# EAGLE design magnet-node (EAGLE 6.5.0)
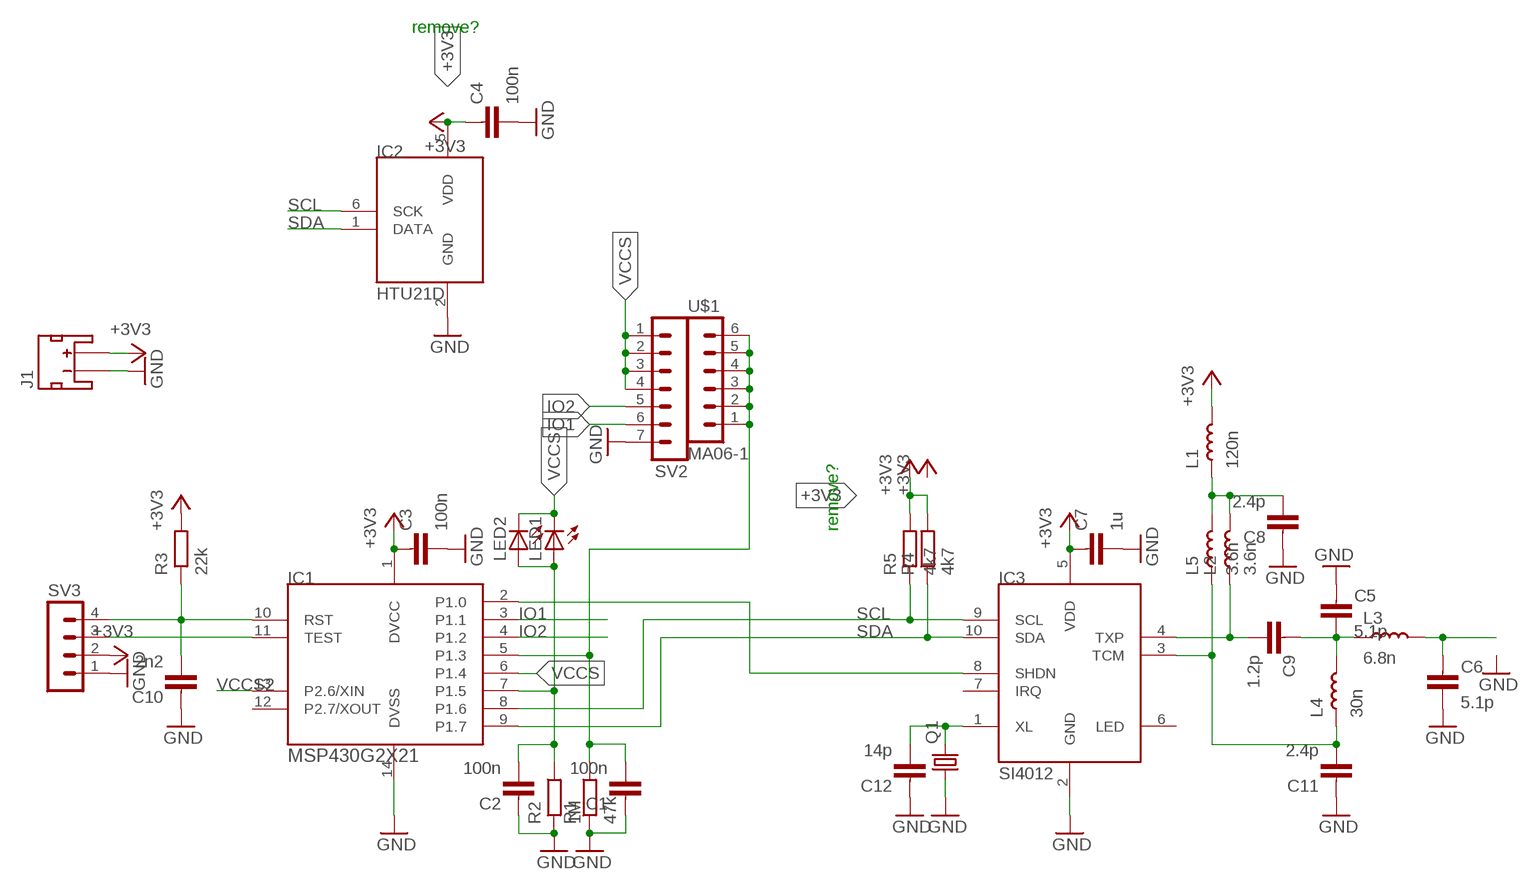
[diagram p0: schematic, sheet 1]

## Parts
C1  100n  CAPACITOR0603-N  [C0603-N]
C2  100n  CAPACITOR0603-N  [C0603-N]
C3  100n  CAPACITOR0603-N  [C0603-N]
C4  100n  CAPACITOR0603-N  [C0603-N]
C5  5.1p  CAPACITOR0603-N  [C0603-N]
C6  5.1p  CAPACITOR0603-N  [C0603-N]
C7  1u  CAPACITOR0603-N  [C0603-N]
C8  2.4p  CAPACITOR0603-N  [C0603-N]
C9  1.2p  CAPACITOR0603-N  [C0603-N]
C10  2n2  CAPACITOR0603-N  [C0603-N]
C11  2.4p  CAPACITOR0603-N  [C0603-N]
C12  14p  CAPACITOR0603-N  [C0603-N]
IC1  MSP430G2X21  [TSSOP14]
IC2  HTU21D  [DFN6-L]
IC3  SI4012  [MSOP10]
J1  JST_2MM_MALE_TH  [JST-2-TH]
L1  120n  INDUCTOR0603-N  [L0603-N]
L2  3.6n  INDUCTOR0402-N  [L0402-N]
L3  6.8n  INDUCTOR0402-N  [L0402-N]
L4  30n  INDUCTOR0402-N  [L0402-N]
L5  3.6n  INDUCTOR0402-N  [L0402-N]
LED1  LEDSMT1206  [1206]
LED2  LEDSMT1206  [1206]
Q1  CRYSTALHC49S  [HC49/S]
R1  47k  RESISTOR0603-N  [R0603-N]
R2  1M  RESISTOR0603-N  [R0603-N]
R3  22k  RESISTOR0603-N  [R0603-N]
R4  4k7  RESISTOR0603-N  [R0603-N]
R5  4k7  RESISTOR0603-N  [R0603-N]
SV2  MA07-1S  [MA07-1-SMD]
SV3  MA04-1E  [EDGE_4]
U$1  MA06-1  [MA06-1-SMD]

## Nets
+3V3: C3.1 C4.1 C7.1 IC1.1(DVCC) IC2.5(VDD) IC3.5(VDD) J1.1(+) L1.2 R3.2 R4.2 R5.2 SV3.2
GND: C1.1 C2.1 C3.2 C4.2 C5.1 C6.2 C7.2 C8.1 C10.1 C11.1 C12.1 IC1.14(DVSS) IC2.2(GND) IC3.2(GND) J1.2(-) Q1.1 R1.1 R2.1 SV2.7 SV3.1
IO1: IC1.3(P1.1) SV2.6
IO2: IC1.4(P1.2) SV2.5
N$1: IC1.2(P1.0) IC3.8(SHDN)
N$2: IC1.11(TEST) SV3.3
N$4: C8.2 L1.1 L2.2 L5.2
N$5: C12.2 IC3.1(XL) Q1.2
N$7: C5.2 C9.1 L3.1 L4.2
N$8: C11.2 IC3.3(TCM) L4.1 L5.1
N$9: C9.2 IC3.4(TXP) L2.1
N$10: C6.1 L3.2
N$12: C1.2 IC1.5(P1.3) R1.2 U$1.1 U$1.2 U$1.3 U$1.4 U$1.5 U$1.6
N$13: C2.2 IC1.7(P1.5) LED1.A LED2.A R2.2
N$15: C10.2 IC1.10(RST) R3.1 SV3.4
SCL: IC1.8(P1.6) IC2.6(SCK) IC3.9(SCL) R5.1
SDA: IC1.9(P1.7) IC2.1(DATA) IC3.10(SDA) R4.1
VCCS: IC1.6(P1.4) LED1.C LED2.C SV2.1 SV2.2 SV2.3 SV2.4
VCCS2: IC1.13(P2.6/XIN)
Unconnected: IC1.12(P2.7/XOUT) IC3.6(LED) IC3.7(IRQ)

## Notes on the sheet
- remove?
- remove?

## Library data of the parts
C1-C12 = passives-7351:CAPACITOR
IC1 = Mine:MSP430G2X21
IC2 = Mine:HTU21D
IC3 = Mine:SI4012
J1 = dtb:JST_2MM_MALE_TH: Mates to single-cell LiPo batteries. CONN-08352
L1-L5 = passives-7351:INDUCTOR
LED1 LED2 = led:LED: LED OSRAM: - CHIPLED LG R971, LG N971, LY N971, LG Q971, LY Q971, LO R971, LY R971 LH N974, LH R974 LS Q976, LO Q976, LY Q976 LO Q996 - Hyper CHIPLED LW Q18S LB Q993, LB Q99A, LB R99A - SideLED LS A670, LO A670, LY A670, LG A670, LP A670 LB A673, LV A673, LT A673, LW A673 LH A674 LY A675 LS A676, LA A676, LO A676, LY A676, LW A676 LS A679, LY A679, LG A679 - Hyper Micro SIDELED® LS Y876, LA Y876, LO Y876, LY Y876 LT Y87S - SmartLED LW L88C, LW L88S LB L89C, LB L89S, LG L890 LS L89K, LO L89K, LY L89K LS L896, LA L896, LO L896, LY L896 - TOPLED LS T670, LO T670, LY T670, LG T670, LP T670 LSG T670, LSP T670, LSY T670, LOP T670, LYG T670 LG T671, LOG T671, LSG T671 LB T673, LV T673, LT T673, LW T673 LH T674 LS T676, LA T676, LO T676, LY T676, LB T676, LH T676, LSB T676, LW T676 LB T67C, LV T67C, LT T67C, LS T67K, LO T67K, LY T67K, LW E67C LS E67B, LA E67B, LO E67B, LY E67B, LB E67C, LV E67C, LT E67C LW T67C LS T679, LY T679, LG T679 LS T770, LO T770, LY T770, LG T770, LP T770 LB T773, LV T773, LT T773, LW T773 LH T774 LS E675, LA E675, LY E675, LS T675 LS T776, LA T776, LO T776, LY T776, LB T776 LHGB T686 LT T68C, LB T68C - Hyper Mini TOPLED® LB M676 - Mini TOPLED Santana® LG M470 LS M47K, LO M47K, LY M47K Source: http://www.osram.convergy.de LUXEON: - LUMILED® LXK2-PW12-R00, LXK2-PW12-S00, LXK2-PW14-U00, LXK2-PW14-V00 LXK2-PM12-R00, LXK2-PM12-S00, LXK2-PM14-U00 LXK2-PE12-Q00, LXK2-PE12-R00, LXK2-PE12-S00, LXK2-PE14-T00, LXK2-PE14-U00 LXK2-PB12-K00, LXK2-PB12-L00, LXK2-PB12-M00, LXK2-PB14-N00, LXK2-PB14-P00, LXK2-PB14-Q00 LXK2-PR12-L00, LXK2-PR12-M00, LXK2-PR14-Q00, LXK2-PR14-R00 LXK2-PD12-Q00, LXK2-PD12-R00, LXK2-PD12-S00 LXK2-PH12-R00, LXK2-PH12-S00 LXK2-PL12-P00, LXK2-PL12-Q00, LXK2-PL12-R00 Source: www.luxeon.com KINGBRIGHT: KA-3528ASYC Source: www.kingbright.com
Q1 = crystal:CRYSTAL: CRYSTAL; OC_FARNELL: 1667008; OC_NEWARK: unknown
R1-R5 = passives-7351:RESISTOR
SV2 = Mine:MA07-1: PIN HEADER
SV3 = Mine:MA04-1: PIN HEADER
U$1 = Mine:MA06-1

## Board
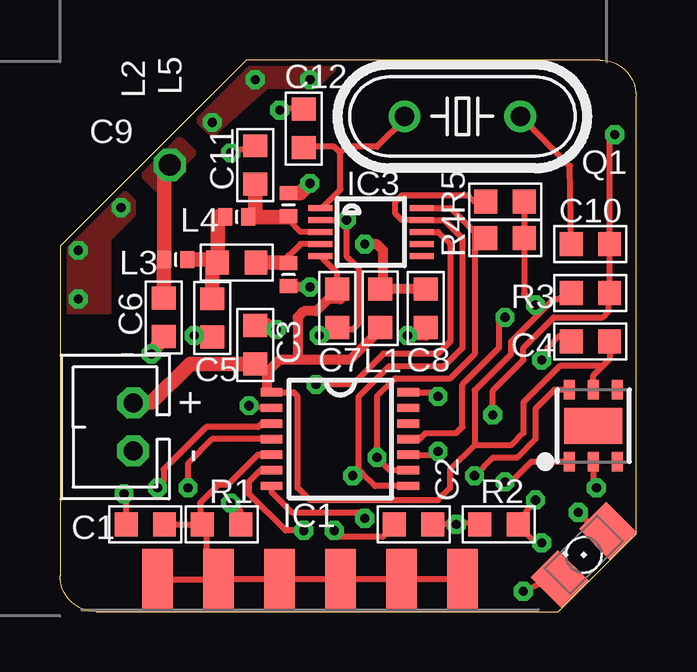
[diagram p1: board, top side]
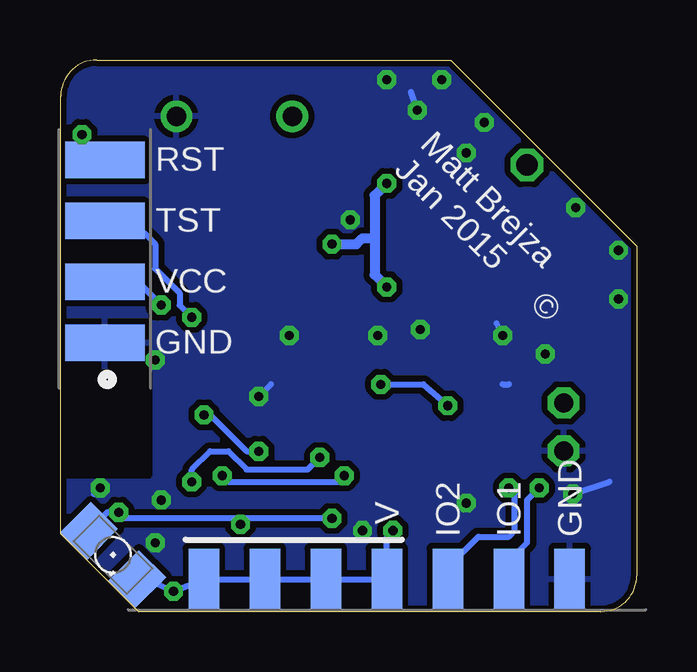
[diagram p2: board, bottom side, seen from below]

Size 24 x 23 mm. Coordinates in mm from the lower left corner, seen from the top.
Outline: 0,15.25 0,1.5 arc90 1.5,0 20.75,0 24,3.25 24,21.5 arc90 22.5,23 7.75,23 0,15.25
Copper layers (1*16): Top 0.035mm / dielectric 1.5mm / Bottom 0.035mm
Design rules "default *": minimum track width 8mil, minimum drill 15mil, track to track 8mil, track to pad 8mil, pad to pad 8mil, via to via 8mil, smd to smd 0mil, copper to edge 10mil, drill to drill 8mil, minimum pad ring 10mil, minimum via ring 8mil, stop-mask expansion 4mil, vias tented up to drill 15mil, thermal gap 10mil

### Footprints (pad centres in the part's own frame; a part is rotated, then mirrored left to right if it is on the bottom)
C0603-N = smd 0.95 x 1: 1 -0.8,0; 2 0.8,0
TSSOP14 = smd 0.9 x 0.35: 1 -2.875,1.95; 2 -2.875,1.3; 3 -2.875,0.65; 4 -2.875,0; 5 -2.875,-0.65; 6 -2.875,-1.3; 7 -2.875,-1.95; 8 2.825,-1.95; 9 2.825,-1.3; 10 2.825,-0.65; 11 2.825,0; 12 2.825,0.65; 13 2.825,1.3; 14 2.825,1.95
DFN6-L = smd 0.45 x 0.8: 1 -1,-1.5; 2 0,-1.5; 3 1,-1.5; 4 1,1.5; 5 0,1.5; 6 -1,1.5 | smd 2.4 x 1.5: EP 0,0
MSOP10 = smd 0.25 x 1: 1 -1,-2.113; 2 -0.5,-2.113; 3 0,-2.113; 4 0.5,-2.113; 5 1,-2.113; 6 1,2.113; 7 0.5,2.113; 8 0,2.113; 9 -0.5,2.113; 10 -1,2.113
JST-2-TH = drill 0.8 octagon: 1 1,0; 2 -1,0
L0603-N = smd 0.95 x 1: 1 -0.8,0; 2 0.8,0
L0402-N = smd 0.59 x 0.72: 1 -0.48,0; 2 0.48,0
1206 = smd 1.6 x 1.803: A -1.422,0; C 1.422,0
HC49/S = drill 0.813: 1 -2.413,0; 2 2.413,0
R0603-N = smd 0.95 x 1: 1 -0.8,0; 2 0.8,0
MA07-1-SMD = smd 1.27 x 2.54: 1 -7.62,0; 2 -5.08,0; 3 -2.54,0; 4 0,0; 5 2.54,0; 6 5.08,0; 7 7.62,0
EDGE_4 = smd 1.524 x 3.302: 1 -3.81,0; 2 -1.27,0; 3 1.27,0; 4 3.81,0
MA06-1-SMD = smd 1.27 x 2.54: 1 -7.62,0; 2 -5.08,0; 3 -2.54,0; 4 0,0; 5 2.54,0; 6 5.08,0

### Placement (x,y rotation side)
C1  3.56,3.63 0 top
C2  14.73,3.63 0 top
C3  8.13,11.12 90 top
C4  22.1,11.25 180 top
C5  6.35,12.24 90 top
C6  4.32,12.27 270 top
C7  11.56,12.65 270 top
C8  15.24,12.65 90 top
C9  7.37,14.55 0 top
C10  22.1,15.32 0 top
C11  8.13,18.62 270 top
C12  10.16,20.14 270 top
IC1  11.68,7.19 0 top
IC2  22.22,7.75 0 top
IC3  12.95,15.82 270 top
J1  3.05,7.7 90 top
L1  13.34,12.65 270 top
L2  9.53,14.05 270 top
L3  4.83,14.68 180 top
L4  7.37,16.46 180 top
L5  9.53,16.97 90 top
LED1  21.82,2.36 225 top
LED2  21.82,2.36 315 bottom
Q1  16.77,20.65 180 top
R1  6.73,3.63 180 top
R2  18.29,3.63 180 top
R3  22.1,13.28 180 top
R4  18.54,15.57 0 top
R5  18.54,17.09 0 top
SV2  10.41,1.35 0 bottom
SV3  22.16,15.02 90 bottom
U$1  11.68,1.35 0 top

### Tracks (layer width: path | path; a pad name or v marks a point on that pad's centre or on a via)
+3V3  (via drill 0.38)
  Top 0.229: 20.83,10.24 19.3,8.71
  Top 0.254: C3.1 8.38,10.24 8.64,9.98 | 8.64,9.22 IC1.1 9.73,9.14 9.91,8.97 9.91,5.16 10.41,4.65 15.75,4.65 16.26,5.16 16.26,5.92 17.27,6.93 | 11.68,13.03 C7.1 11.56,14.11 IC3.5 | 20.07,12.52 18.8,11.25 18.8,10.74 17.27,9.22 17.27,6.93 | 20.07,12.52 20.57,13.03 20.74,13.03 R3.2 | 20.07,12.52 v19.81,12.78 19.34,13.25 R4.2 R5.2 | IC2.5 22.22,9.85 22.61,10.24 | C4.1 22.9,10.53 22.61,10.24 | 22.61,10.24 20.83,10.24 | 19.3,8.71 19.3,7.44 18.8,6.93 17.27,6.93
  Top 0.406: 9.91,10.49 12.06,10.49 13.62,12.05 L1.2 | 9.91,10.49 9.14,10.49 8.64,9.98 8.64,9.22 | 11.68,13.03 11.18,13.03 10.67,12.52 10.16,12.52 9.91,12.27 9.91,10.49
  Top 0.61: C3.1 5.42,10.32 3.81,8.71 3.06,8.71 J1.1
  Bottom 0.254: SV3.2 21.86,14.05 21.08,14.05 v19.81,12.78
GND  (via drill 0.38)
  Top 0.254: IC3.2 v11.93,16.32 v11.94,16.33 11.94,14.81 12.45,14.3 12.45,12.01 12.19,11.76 11.68,11.76 | IC1.14 15.41,9.14 v15.75,8.97 | C11.1 v7.11,19.13 | C5.1 v5.59,11.51 | C3.2 8.68,12.1 v9.02,11.76 | C7.2 11.09,11.67 v10.79,11.51 | C12.1 9.75,20.99 v9.15,20.9 | IC2.2 22.22,5.29 v22.35,5.16 | C2.1 13.86,3.53 13.46,3.12 11.68,3.12 v11.43,3.38 | C4.2 20.83,11.51 20.32,11 20.32,10.74 v20.07,10.49 | C10.1 21.25,18.58 Q1.1 | v19.81,4.65 19.65,4.48 R2.1 19.09,3.59 19.81,2.87 v20.07,2.87 | C1.1 2.76,4.81 v2.67,4.9 | R1.1 7.53,4.18 v7.11,4.52
  Top 0.406: C8.1 15.24,11.51 v14.48,11.51
  Top 0.61: v3.81,10.74 C6.2
  Bottom 0.254: v11.94,16.33 12.19,16.33 | 5.59,9.47 5.33,9.47 | v15.75,8.97 15.24,9.47 | v5.59,11.51 5.84,12.01 | v10.79,11.51 10.67,11.51 | v9.15,20.9 9.4,21.67 | v22.35,5.16 22.61,4.9 | v11.43,3.38 11.18,3.38 | v19.81,4.65 19.81,4.9 | v2.67,4.9 1.14,5.41
  other vias: 0.76,13.03 2.54,16.84 0.76,15.06 8.13,22.17 6.35,20.4 10.41,22.17
  pour Bottom (isolate 0.254): 0,22.94 24.13,22.94 24.13,-0.18 0,-0.18
  pour Top: 0,12.52 2.03,12.52 2.03,15.57 3.05,16.59 3.05,17.09 2.29,17.86 2.03,17.86 -0.25,15.57 -0.25,12.78
  pour Top: 6.35,19.89 8.64,21.92 10.67,21.92 11.94,23.19 7.37,23.19 5.33,21.16 5.33,20.9
IO1  (via drill 0.38)
  Top 0.254: IC1.3 8.4,7.84 8.26,7.7 6.1,7.7 4.32,5.92 4.32,5.41 v4.06,5.16
  Bottom 0.254: SV2.6 5.33,2.11 4.57,2.87 4.57,4.65 v4.06,5.16
IO2  (via drill 0.38)
  Top 0.254: IC1.4 6.35,7.19 5.33,6.17 v5.33,5.16
  Bottom 0.254: SV2.5 7.87,1.85 6.6,3.12 5.33,3.12 5.08,3.38 5.08,4.9 v5.33,5.16
N$1  (via drill 0.38)
  Top 0.254: IC3.8 15.75,15.82 16.26,15.32 16.26,11.25 15.75,10.74 13.46,10.74 12.19,9.47 v10.67,9.47 | v7.87,8.59 8.78,8.46 IC1.2
  Bottom 0.254: v10.67,9.47 8.89,9.47 v7.87,8.59
N$2  (via drill 0.38)
  Top 0.254: v18.54,12.27 18.29,12.01 18.29,11 16.76,9.47 16.76,7.7 16.51,7.44 15.24,7.44 14.99,7.19 IC1.11
  Bottom 0.254: v18.54,12.27 19.05,12.78 19.05,13.28 20.07,14.3 20.07,15.32 21.04,16.29 SV3.3
N$3
  cutout Bottom: 23.88,9.98 20.32,9.98 20.32,5.66 24.13,5.66 24.13,6.17
N$4  (via drill 0.38)
  Top 0.254: L2.2 9.77,13.57 9.79,13.54
  Top 0.406: 10.3,17.74 v10.41,17.86 | v10.41,13.54 9.79,13.54 | 13.46,13.58 13.46,13.45 C8.2 | 13.46,13.58 13.46,15.06 13.21,15.32 v12.7,15.32 | 13.46,13.58 L1.1
  Top 0.61: L5.2 10.01,17.45 v10.41,17.86
  Bottom 0.406: v10.41,17.86 10.92,17.35 10.92,15.57 | 10.92,15.57 10.92,14.05 v10.41,13.54 | v12.7,15.32 11.68,15.32 11.43,15.57 10.92,15.57
N$5
  Top 0.254: IC3.1 10.91,16.82 11.68,17.6 11.68,19.13 | 11.68,19.13 11.43,19.38 10.25,19.38 C12.2 | Q1.2 14.36,20.53 13.21,19.38 11.94,19.38 11.68,19.13
N$7
  Top 0.61: 6.6,14.47 C9.1 | C5.2 6.35,14.39 C9.1 | L3.1 6.57,14.68 C9.1 | C9.1 6.57,16.46 L4.2
N$8
  Top 0.254: IC3.3 10.02,15.82 9.53,16.32
  Top 0.305: 9.53,16.32 L5.1
  Top 0.61: C11.2 8.13,16.44 | 8.13,16.44 9.48,16.44 L5.1 | 8.13,16.44 7.86,16.44 L4.1
N$9
  Top 0.254: IC3.4 10.03,15.32 9.53,14.82 | L2.1 9.54,14.55
  Top 0.305: 9.53,14.82 L2.1
  Top 0.61: C9.2 9.54,14.55
N$10  (via drill 0.9)
  Top 0.61: C6.1 4.32,14.65 L3.2 4.35,18.39 v4.57,18.62
  pour Top: 3.05,18.87 3.05,18.62 4.06,17.6 5.59,19.13 4.57,20.14
N$12
  Top 0.254: 6.1,1.47 6.1,3.63 R1.2 | 6.1,1.47 6.1,1.35 U$1.1 | C1.2 R1.2 | IC1.5 8.24,6.54 6.99,5.28 6.6,5.28 5.84,4.52 5.84,3.54 R1.2 | U$1.6 U$1.5 U$1.4 U$1.3 U$1.2 6.22,1.35 6.1,1.47
N$13  (via drill 0.38)
  Top 0.254: IC1.7 8.81,4.98 9.65,4.14 12.45,4.14 v12.7,3.89 | LED2.A 22.36,3.37 v21.59,4.14 | C2.2 v16.51,3.63 16.84,3.71 R2.2
  Bottom 0.254: LED2.A 22.06,4.14 v21.59,4.14 21.34,3.89 16.51,3.89 | v12.7,3.89 16.51,3.89 | 16.51,3.89 v16.51,3.63
N$15  (via drill 0.38)
  Top 0.254: IC1.10 15.64,6.54 v15.75,6.68 | 22.95,19.73 v23.11,19.89 22.9,19.68 C10.2 R3.1 22.86,13.45 22.86,12.52 22.61,12.27 20.57,12.27 19.3,11 19.3,10.49 18.03,9.22 v18.03,8.2
  Bottom 0.254: SV3.4 22.2,18.87 22.86,18.87 23.11,19.38 v23.11,19.89 | v18.03,8.2 17.78,8.2 16.26,6.68 v15.75,6.68
SCL  (via drill 0.38)
  Top 0.254: IC1.8 13.13,5.24 12.57,5.79 | 12.57,5.79 12.45,5.92 12.45,8.97 13.72,10.24 16,10.24 16.76,11 16.76,15.57 16.01,16.32 IC3.9 14.23,16.32 13.97,16.59 13.97,17.09 14.22,17.35 17.02,17.35 17.27,17.09 R5.1 | v12.19,5.66 12.57,5.79 | v17.27,5.66 18.03,6.43 19.05,6.43 19.81,7.19 19.81,8.46 20.6,9.25 IC2.6
  Bottom 0.254: v17.27,5.66 17.02,5.41 12.45,5.41 v12.19,5.66
SDA  (via drill 0.38)
  Top 0.254: IC2.1 19.64,6.25 18.8,5.41 v18.54,5.41 | IC1.9 13.75,5.89 v13.21,6.43 13.21,8.97 13.97,9.73 16.26,9.73 17.27,10.74 17.27,15.06 | IC3.10 16.27,16.82 17.27,15.82 17.27,15.06 | R4.1 17.27,15.06
  Bottom 0.254: v18.54,5.41 18.54,5.92 17.78,6.68 17.02,6.68 16.26,5.92 13.72,5.92 v13.21,6.43
VCCS  (via drill 0.38)
  Top 0.254: IC1.6 8.35,5.89 7.87,5.41 7.87,4.9 9.4,3.38 v10.16,3.38 | LED2.C 21.18,1.7 v19.3,0.84
  Bottom 0.254: LED2.C 21.18,1.7 v19.3,0.84 SV2.1 SV2.2 SV2.3 SV2.4 10.41,3.12 v10.16,3.38

### Text on the board
bPlace: Matt Brejza / Jan 2015 | RST | TST | © | VCC | GND | GND | IO1 | IO2 | V